# EAGLE design lesson1 (EAGLE 7.6.0)
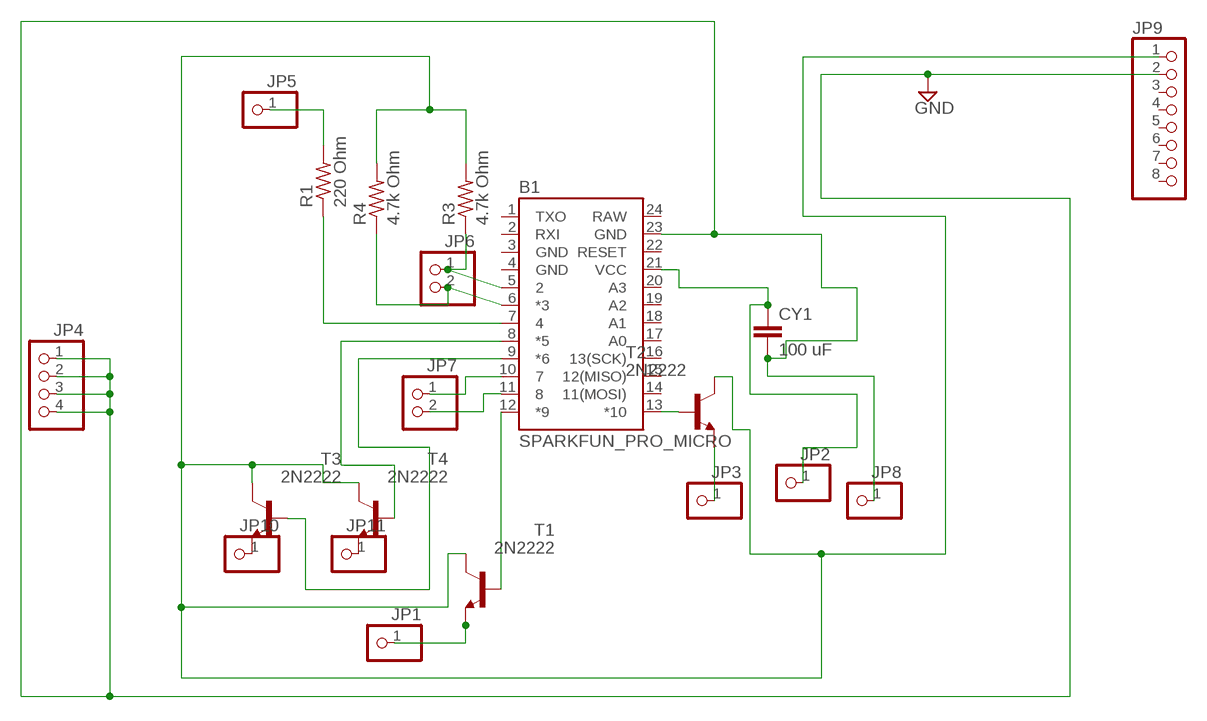
[diagram p0: schematic, sheet 1]

## Parts
B1  SPARKFUN_PRO_MICRO  [SPARKFUN_PRO_MICRO]
CY1  100 uF  CYYC7B5  [YC7B5]
JP1  PINHD-1X1  [1X01]
JP2  PINHD-1X1  [1X01]
JP3  PINHD-1X1  [1X01]
JP4  PINHD-1X4  [1X04]
JP5  PINHD-1X1  [1X01]
JP6  PINHD-1X2  [1X02]
JP7  PINHD-1X2  [1X02]
JP8  PINHD-1X1  [1X01]
JP9  PINHD-1X8  [1X08]
JP10  PINHD-1X1  [1X01]
JP11  PINHD-1X1  [1X01]
R1  220 Ohm  R-US_V526-0  [V526-0]
R3  4.7k Ohm  R-US_V526-0  [V526-0]
R4  4.7k Ohm  R-US_V526-0  [V526-0]
T1  2N2222  [TO18]
T2  2N2222  [TO18]
T3  2N2222  [TO18]
T4  2N2222  [TO18]

## Nets
GND: B1.23(GND) CY1.2 JP4.1 JP4.2 JP4.3 JP4.4 JP8.1 JP9.2
N$1: B1.13(*10) T2.2(B)
N$2: B1.12(*9) T1.2(B)
N$3: JP3.1 T2.1(E)
N$4: B1.10 JP7.1
N$5: JP5.1 R1.2
N$6: JP1.1 T1.1(E)
N$7: B1.6(*3) JP6.2 R4.1
N$8: B1.7 R1.1
N$9: B1.11 JP7.2
N$10: B1.5 JP6.1 R3.1
N$11: JP11.1 T4.1(E)
N$12: B1.21(VCC) CY1.1 JP2.1
N$13: JP10.1 T3.1(E)
N$14: B1.9(*6) T3.2(B)
N$16: JP9.1 R3.2 R4.2 T1.3(C) T2.3(C) T3.3(C) T4.3(C)
N$18: B1.8(*5) T4.2(B)
Unconnected: B1.1(TXO) B1.2(RXI) B1.14(11(MOSI)) B1.15(12(MISO)) B1.16(13(SCK)) B1.17(A0) B1.18(A1) B1.19(A2) B1.20(A3) B1.22(RESET) JP9.3 JP9.4 JP9.5 JP9.6 JP9.7 JP9.8

## Power pins joined to a net without a drawn wire
GND: B1.3(GND) B1.4(GND)
RAW: B1.24(RAW)

## Library data of the parts
B1 = SparkFun-Boards:SPARKFUN_PRO_MICRO: SparkFun Pro Micro Atmega32U4 compatible footprint. SparkFun Products: 3.3V/8MHz <https://www.sparkfun.com/products/12587> 5V/16MHz <https://www.sparkfun.com/products/12640>
CY1 = resistor:CY: Y CAPACITOR for power line
JP1-JP3 JP5 JP8 JP10 JP11 = pinhead:PINHD-1X1: PIN HEADER
JP4 = pinhead:PINHD-1X4: PIN HEADER
JP6 JP7 = pinhead:PINHD-1X2: PIN HEADER
JP9 = pinhead:PINHD-1X8: PIN HEADER
R1 R3 R4 = rcl:R-US_: RESISTOR, American symbol
T1-T4 = transistor:2N2222: NPN TRANSISTOR

## Module ALL
Ports: 

### Library data of the parts

## Board
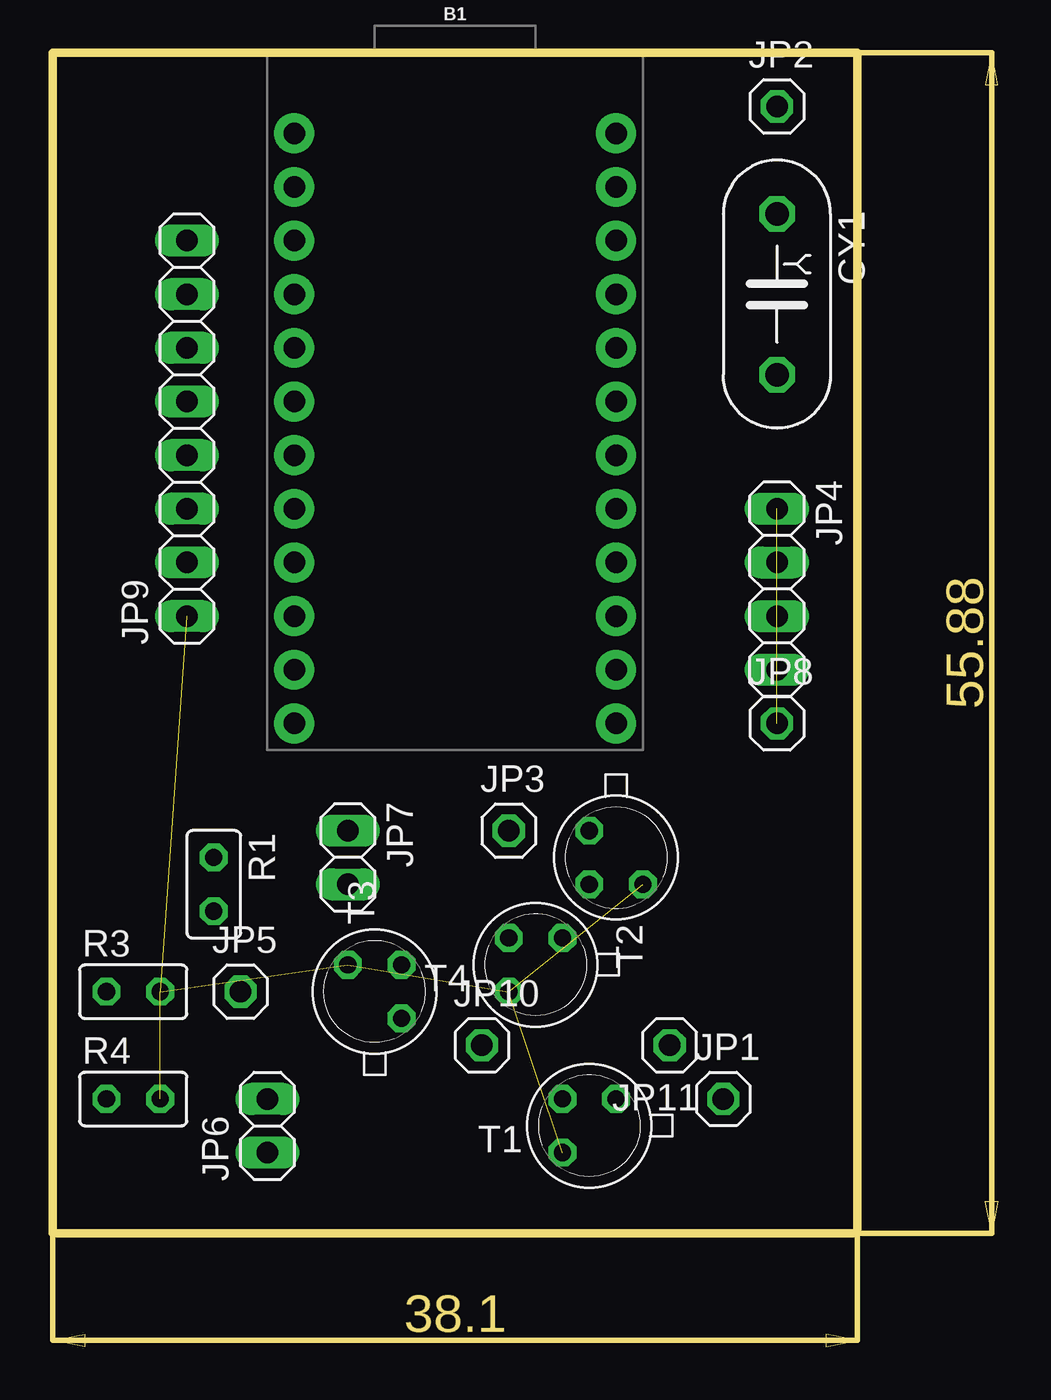
[diagram p1: board, top side]
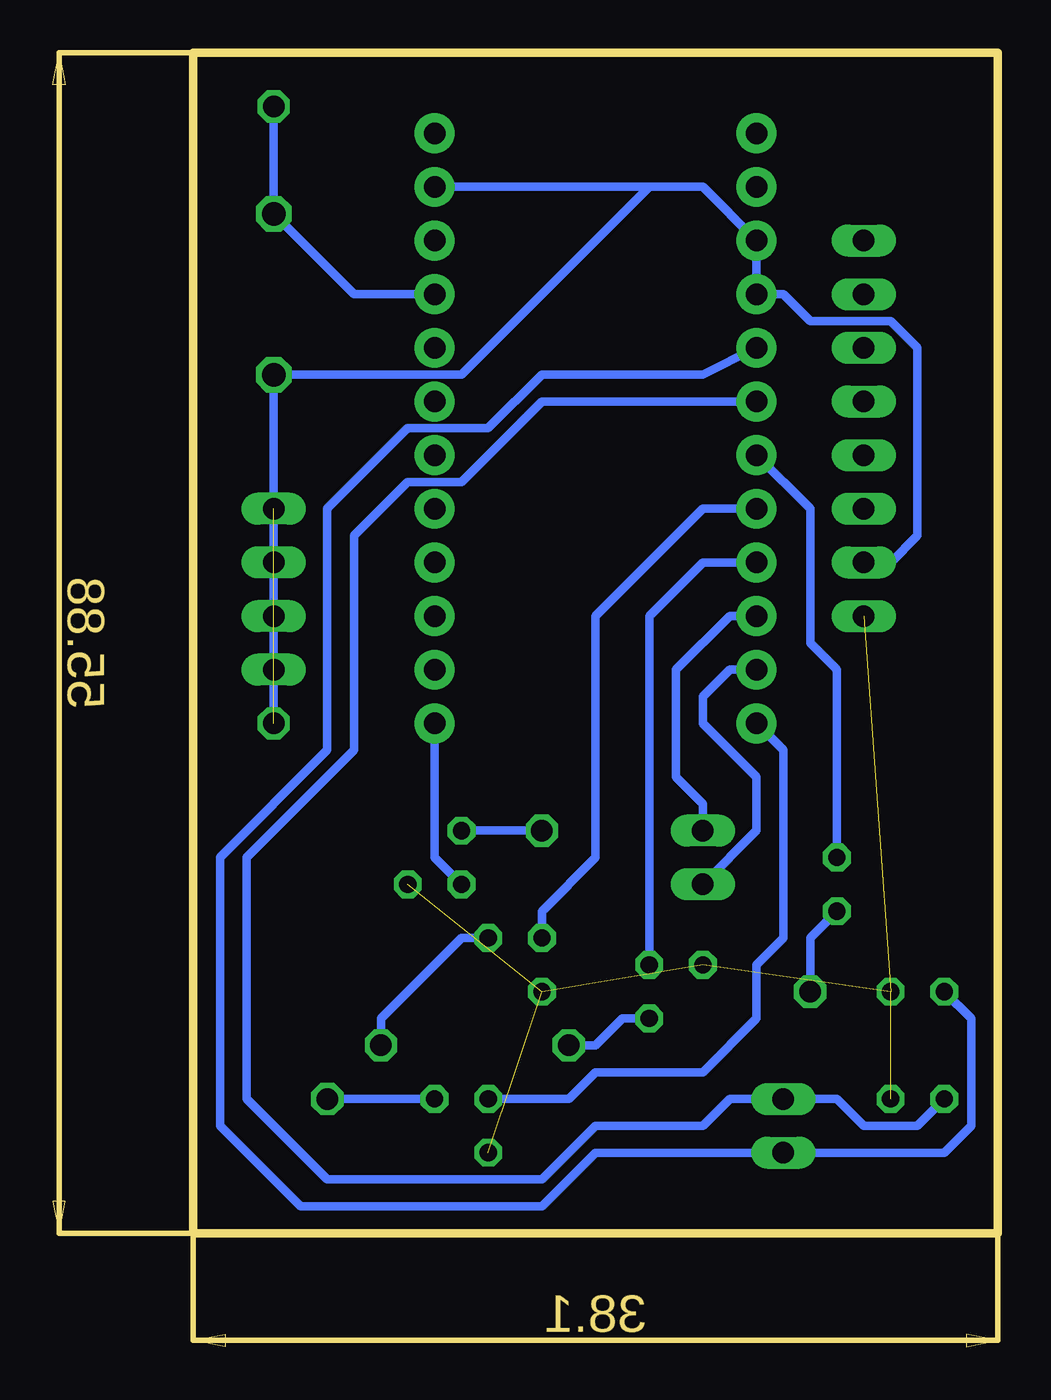
[diagram p2: board, bottom side, seen from below]

Size 38.1 x 55.88 mm. Coordinates in mm from the lower left corner, seen from the top.
Outline: 0,0 0,55.88 38.1,55.88 38.1,0 0,0
Copper layers (1*16): Top 0.035mm / dielectric 1.5mm / Bottom 0.035mm
Design rules "default": minimum track width 10mil, minimum drill 24mil, track to track 8mil, track to pad 8mil, pad to pad 8mil, via to via 8mil, smd to smd 8mil, copper to edge 40mil, drill to drill 8mil, minimum pad ring 10mil, minimum via ring 8mil, stop-mask expansion 4mil, vias tented up to drill 0mil, thermal gap 10mil

### Footprints (pad centres in the part's own frame; a part is rotated, then mirrored left to right if it is on the bottom)
SPARKFUN_PRO_MICRO = drill 1.016 pad 1.88: 1 -7.62,12.7; 2 -7.62,10.16; 3 -7.62,7.62; 4 -7.62,5.08; 5 -7.62,2.54; 6 -7.62,0; 7 -7.62,-2.54; 8 -7.62,-5.08; 9 -7.62,-7.62; 10 -7.62,-10.16; 11 -7.62,-12.7; 12 -7.62,-15.24; 13 7.62,-15.24; 14 7.62,-12.7; 15 7.62,-10.16; 16 7.62,-7.62; 17 7.62,-5.08; 18 7.62,-2.54; 19 7.62,0; 20 7.62,2.54; 21 7.62,5.08; 22 7.62,7.62; 23 7.62,10.16; 24 7.62,12.7
YC7B5 = drill 1.118 octagon: 1 -3.81,0; 2 3.81,0
1X01 = drill 1.016 octagon: 1 0,0
1X04 = drill 1.016 long: 1 -3.81,0; 2 -1.27,0; 3 1.27,0; 4 3.81,0
1X02 = drill 1.016 long: 1 -1.27,0; 2 1.27,0
1X08 = drill 1.016 long: 1 -8.89,0; 2 -6.35,0; 3 -3.81,0; 4 -1.27,0; 5 1.27,0; 6 3.81,0; 7 6.35,0; 8 8.89,0
V526-0 = drill 0.813 octagon: 1 -1.27,0; 2 1.27,0
TO18 = drill 0.813 octagon: 1 -1.27,-1.27; 2 1.27,-1.27; 3 1.27,1.27

### Placement (x,y rotation side)
B1  19.05,39.37 0 top
CY1  34.29,44.45 270 top
JP1  31.75,6.35 0 top
JP2  34.29,53.34 0 top
JP3  21.59,19.05 0 top
JP4  34.29,30.48 270 top
JP5  8.89,11.43 0 top
JP6  10.16,5.08 90 top
JP7  13.97,17.78 270 top
JP8  34.29,24.13 0 top
JP9  6.35,38.1 90 top
JP10  20.32,8.89 0 top
JP11  29.21,8.89 180 top
R1  7.62,16.51 270 top
R3  3.81,11.43 0 top
R4  3.81,6.35 0 top
T1  25.4,5.08 180 top
T2  26.67,17.78 270 top
T3  15.24,11.43 90 top
T4  22.86,12.7 180 top

### Tracks (layer width: path | path; a pad name or v marks a point on that pad's centre or on a via)
GND  (4 unrouted)
  Bottom 0.406: B1.23 16.51,49.53 | 16.51,49.53 13.97,49.53 B1.3 B1.4 10.16,44.45 8.89,43.18 5.08,43.18 3.81,41.91 3.81,33.02 5.08,31.75 JP9.2 | JP8.1 CY1.2 25.4,40.64 16.51,49.53
N$1
  Bottom 0.406: T2.2 26.67,17.78 B1.13
N$2
  Bottom 0.406: B1.12 10.16,22.86 10.16,13.97 11.43,12.7 11.43,10.16 13.97,7.62 19.05,7.62 20.32,6.35 T1.2
N$3
  Bottom 0.406: JP3.1 T2.1
N$4
  Bottom 0.406: JP7.1 13.97,20.32 15.24,21.59 15.24,26.67 12.7,29.21 B1.10
N$5
  Bottom 0.406: JP5.1 8.89,13.97 R1.2
N$6
  Bottom 0.406: T1.1 JP1.1
N$7
  Bottom 0.406: B1.6 21.59,39.37 25.4,35.56 27.94,35.56 30.48,33.02 30.48,22.86 35.56,17.78 35.56,6.35 31.75,2.54 21.59,2.54 19.05,5.08 13.97,5.08 12.7,6.35 JP6.2 7.62,6.35 6.35,5.08 3.81,5.08 R4.1
N$8
  Bottom 0.406: B1.7 8.89,34.29 8.89,27.94 7.62,26.67 R1.1
N$9
  Bottom 0.406: JP7.2 11.43,19.05 11.43,21.59 13.97,24.13 13.97,25.4 12.7,26.67 B1.11
N$10
  Bottom 0.406: B1.5 13.97,40.64 21.59,40.64 24.13,38.1 27.94,38.1 31.75,34.29 31.75,22.86 36.83,17.78 36.83,5.08 33.02,1.27 21.59,1.27 19.05,3.81 JP6.1 2.54,3.81 1.27,5.08 1.27,10.16 R3.1
N$11
  Bottom 0.406: T4.1 25.4,13.97 29.21,10.16 JP11.1
N$12
  Bottom 0.406: JP2.1 CY1.1 30.48,44.45 B1.21
N$13
  Bottom 0.406: T3.1 17.78,10.16 19.05,8.89 JP10.1
N$14
  Bottom 0.406: B1.9 13.97,31.75 16.51,29.21 T3.2
N$16  (6 unrouted)
N$18
  Bottom 0.406: B1.8 13.97,34.29 19.05,29.21 19.05,17.78 21.59,15.24 T4.2